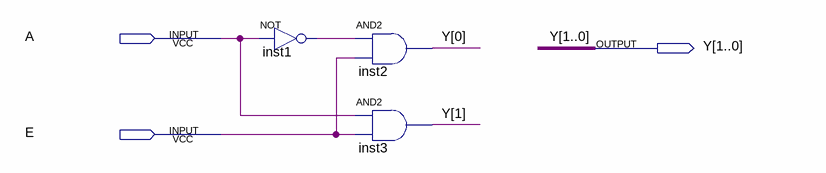
[diagram p0: schematic sheet]
// Quartus schematic Decoder_1x2.bdf as structural Verilog: 3 symbols, 3 pins
module Decoder_1x2 (
  input  A,
  input  E,
  output [1:0] Y
);

  wire inst1_out;

  not inst1 (inst1_out, A);
  and inst2 (Y[0], inst1_out, E);
  and inst3 (Y[1], A, E);
endmodule
